# Altium schematic sheet PDM-S01-V00-PowerDistributionModule.SchDoc: PDM Master
size A3; DrawnBy: Zoe Goodward; Organization: QUT Motorsport; Address1: O-120, Gardens Point; Address2: 2 George Street; Address3: Brisbane, QLD 4000; Address4: Australia; DocumentNumber: 1; Revision: 01; SheetNumber: 1; SheetTotal: 9; Version: 01; Project: Power Distribution Module; PageSetup: Record=PageOptions|CenterHorizontal=True|CenterVertical=True|PrintScale=0.97|XCorrection=1.00|YCorrection=1.00|PrintKind=0|BorderSize=5000000|LeftOffset=0|BottomOffset=0|Orientation=2|PaperLength=1000|PaperWidth=1000|Scale=100|PaperSource=7|PrintQuality=-4|MediaType=1|DitherType=10|PaperKind=A4|PrintScaleMode=1
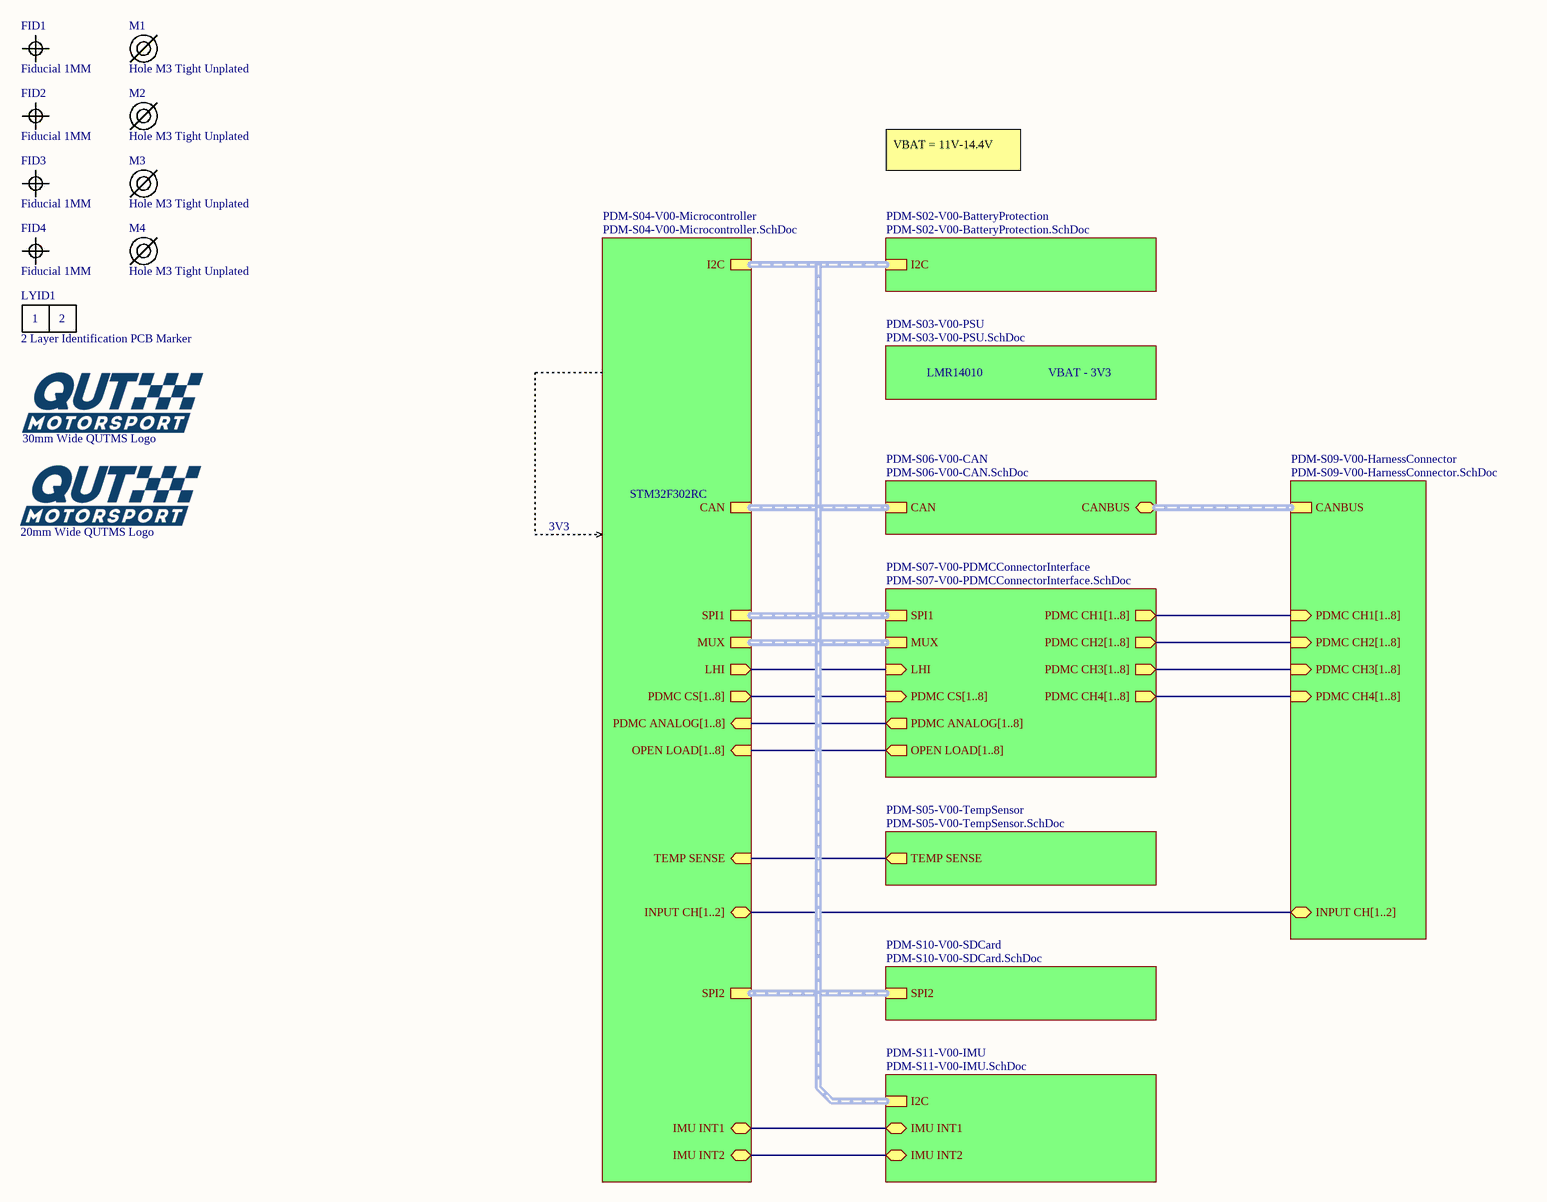
[diagram p0: PDM-S01-V00-PowerDistributionModule.SchDoc]

## Parts
FID1  Fiducial 1MM  [FIDUCIAL 1MM]
FID2  Fiducial 1MM  [FIDUCIAL 1MM]
FID3  Fiducial 1MM  [FIDUCIAL 1MM]
FID4  Fiducial 1MM  [FIDUCIAL 1MM]
LOGO1  30mm Wide QUTMS Logo  [QUTMS LOGO 30MM]
LOGO2  20mm Wide QUTMS Logo  [QUTMS LOGO 20MM]
LYID1  2 Layer Identification PCB Marker  [LAYER IDENT 2]
M1  Hole M3 Tight Unplated  [M3.2 UNPLATED]
M2  Hole M3 Tight Unplated  [M3.2 UNPLATED]
M3  Hole M3 Tight Unplated  [M3.2 UNPLATED]
M4  Hole M3 Tight Unplated  [M3.2 UNPLATED]

## Sub-sheets
PDM-S02-V00-BatteryProtection = PDM-S02-V00-BatteryProtection.SchDoc: I2C (harness I2C)
PDM-S03-V00-PSU = PDM-S03-V00-PSU.SchDoc: no entries
PDM-S04-V00-Microcontroller = PDM-S04-V00-Microcontroller.SchDoc: CAN (harness CAN), LHI (out), MUX (harness MUX), PDMC CS[1..8] (out), PDMC ANALOG[1..8] (in), TEMP SENSE (in), INPUT CH[1..2] (bidir), SPI2 (harness SPI2), I2C (harness I2C), OPEN LOAD[1..8] (in), SPI1 (harness SPI1), IMU INT1 (bidir), IMU INT2 (bidir)
PDM-S05-V00-TempSensor = PDM-S05-V00-TempSensor.SchDoc: TEMP SENSE (out)
PDM-S06-V00-CAN = PDM-S06-V00-CAN.SchDoc: CANBUS (bidir, harness CANBUS), CAN (harness CAN)
PDM-S07-V00-PDMCConnectorInterface = PDM-S07-V00-PDMCConnectorInterface.SchDoc: SPI1 (harness SPI1), PDMC CS[1..8] (in), MUX (harness MUX), PDMC CH4[1..8] (out), PDMC CH2[1..8] (out), LHI (in), PDMC CH1[1..8] (out), PDMC ANALOG[1..8] (out), PDMC CH3[1..8] (out), OPEN LOAD[1..8] (out)
PDM-S09-V00-HarnessConnector = PDM-S09-V00-HarnessConnector.SchDoc: CANBUS (harness CANBUS), PDMC CH1[1..8] (in), PDMC CH2[1..8] (in), PDMC CH3[1..8] (in), PDMC CH4[1..8] (in), INPUT CH[1..2] (bidir)
PDM-S10-V00-SDCard = PDM-S10-V00-SDCard.SchDoc: SPI2 (harness SPI2)
PDM-S11-V00-IMU = PDM-S11-V00-IMU.SchDoc: IMU INT1 (bidir), I2C (harness I2C), IMU INT2 (bidir)

## Nets
(unnamed): sheet PDM-S04-V00-Microcontroller/LHI, sheet PDM-S07-V00-PDMCConnectorInterface/LHI
(unnamed): sheet PDM-S04-V00-Microcontroller/TEMP SENSE, sheet PDM-S05-V00-TempSensor/TEMP SENSE
(unnamed): sheet PDM-S04-V00-Microcontroller/IMU INT1, sheet PDM-S11-V00-IMU/IMU INT1
(unnamed): sheet PDM-S04-V00-Microcontroller/IMU INT2, sheet PDM-S11-V00-IMU/IMU INT2

## Buses and harness runs
bus sheet PDM-S04-V00-Microcontroller/INPUT CH[1..2] = sheet PDM-S09-V00-HarnessConnector/INPUT CH[1..2]
bus sheet PDM-S04-V00-Microcontroller/OPEN LOAD[1..8] = sheet PDM-S07-V00-PDMCConnectorInterface/OPEN LOAD[1..8]
bus sheet PDM-S04-V00-Microcontroller/PDMC ANALOG[1..8] = sheet PDM-S07-V00-PDMCConnectorInterface/PDMC ANALOG[1..8]
bus sheet PDM-S04-V00-Microcontroller/PDMC CS[1..8] = sheet PDM-S07-V00-PDMCConnectorInterface/PDMC CS[1..8]
bus sheet PDM-S07-V00-PDMCConnectorInterface/PDMC CH1[1..8] = sheet PDM-S09-V00-HarnessConnector/PDMC CH1[1..8]
bus sheet PDM-S07-V00-PDMCConnectorInterface/PDMC CH2[1..8] = sheet PDM-S09-V00-HarnessConnector/PDMC CH2[1..8]
bus sheet PDM-S07-V00-PDMCConnectorInterface/PDMC CH3[1..8] = sheet PDM-S09-V00-HarnessConnector/PDMC CH3[1..8]
bus sheet PDM-S07-V00-PDMCConnectorInterface/PDMC CH4[1..8] = sheet PDM-S09-V00-HarnessConnector/PDMC CH4[1..8]
harness sheet PDM-S02-V00-BatteryProtection/I2C = sheet PDM-S04-V00-Microcontroller/I2C = sheet PDM-S11-V00-IMU/I2C
harness sheet PDM-S04-V00-Microcontroller/CAN = sheet PDM-S06-V00-CAN/CAN
harness sheet PDM-S04-V00-Microcontroller/MUX = sheet PDM-S07-V00-PDMCConnectorInterface/MUX
harness sheet PDM-S04-V00-Microcontroller/SPI1 = sheet PDM-S07-V00-PDMCConnectorInterface/SPI1
harness sheet PDM-S04-V00-Microcontroller/SPI2 = sheet PDM-S10-V00-SDCard/SPI2
harness sheet PDM-S06-V00-CAN/CANBUS = sheet PDM-S09-V00-HarnessConnector/CANBUS

## Notes on the sheet
- VBAT = 11V-14.4V
- LMR14010
- VBAT - 3V3
- 3V3
- STM32F302RC
- Revision History:
- Sheet Title:
- Rev
- Date
- Description
- Project:
- Size:
- Drawn By:
- A3
- Number:
- Revision:
- Sheet
- Version:
- of
- QUT Motorsport
- O-120, Gardens Point
- 2 George Street
- Brisbane, QLD 4000
- Australia
- Print Date:
- Print Time:
- File Name:
- (in symbol Layer Identification 2) 1; 2

## Library data of the parts
LOGO1 = QUTMS Logo 30mm
LOGO2 = QUTMS Logo 20mm
LYID1 = Layer Identification 2
M1-M4 = Hole M3 Tight Unplated: M3.2 Hole, No Plating